# EAGLE design Breakout (EAGLE 7.6.0)
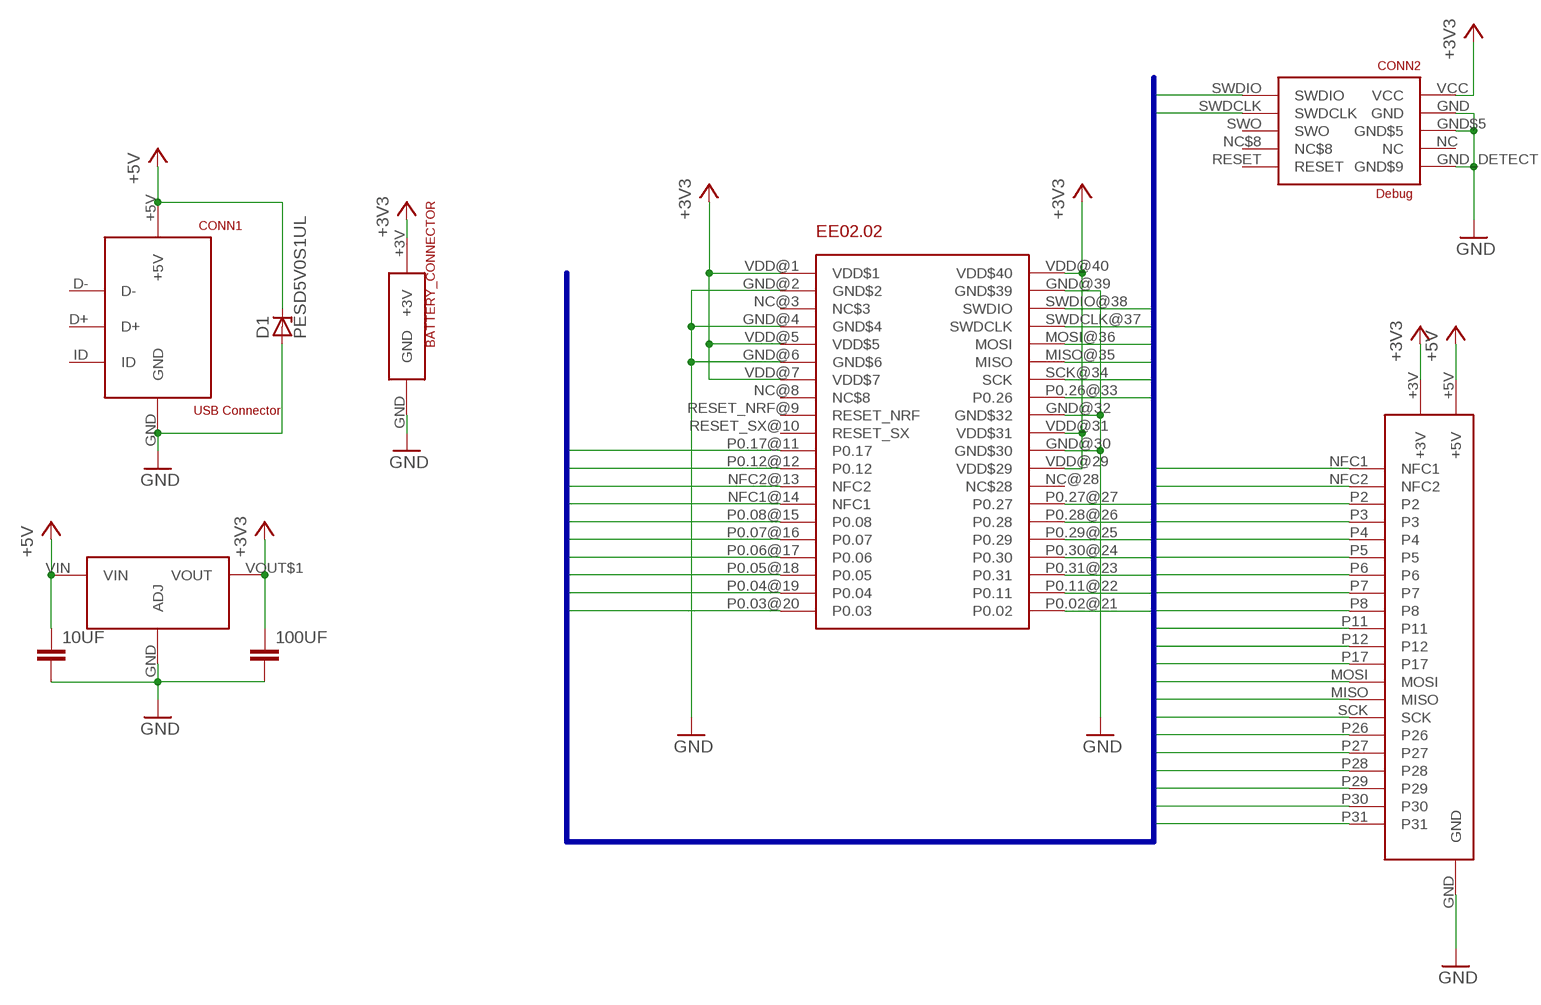
[diagram p0: schematic, sheet 1]

## Parts
10UF  4.7UF-0805  [0805]
100UF  4.7UF-0805  [0805]
BATTERY_CONNECTOR  3V_BATTERY_CONNECTOR  [3V_BATTERY_CONNECTOR]
CONN1  USB Connector  USB_MICRO_B  [USB_MICRO_B]
CONN2  Debug  DEBUGHEADER  [NRF52-P19-CONNECTOR]
D1  PESD5V0S1UL  [SOD882]
EE02.02  EE02_02  [EE02_02]
U$4  LM1117  [SOT-223]
U$5  EE02_SHIELD_HEADERSHIELD  [EE02_SHIELD_HEADER]

## Nets
+3V3: 100UF.1 BATTERY_CONNECTOR.+3V CONN2.VCC EE02.02.VDD@1(VDD$1) EE02.02.VDD@5(VDD$5) EE02.02.VDD@7(VDD$7) EE02.02.VDD@29(VDD$29) EE02.02.VDD@31(VDD$31) EE02.02.VDD@40(VDD$40) U$4.VOUT$1(VOUT) U$5.+3V
+5V: 10UF.1 CONN1.+5V D1.CATHODE(C) U$4.VIN U$5.+5V
GND: 10UF.2 100UF.2 BATTERY_CONNECTOR.GND CONN1.GND CONN2.GND CONN2.GND$5 CONN2.GND_DETECT(GND$9) D1.ANODE(A) EE02.02.GND@2(GND$2) EE02.02.GND@4(GND$4) EE02.02.GND@6(GND$6) EE02.02.GND@30(GND$30) EE02.02.GND@32(GND$32) EE02.02.GND@39(GND$39) U$4.GND(ADJ) U$5.GND
MISO: EE02.02.MISO@35(MISO) U$5.MISO
MOSI: EE02.02.MOSI@36(MOSI) U$5.MOSI
NFC1: EE02.02.NFC1@14(NFC1) U$5.NFC1
NFC2: EE02.02.NFC2@13(NFC2) U$5.NFC2
P2: EE02.02.P0.02@21(P0.02) U$5.P2
P3: EE02.02.P0.03@20(P0.03) U$5.P3
P4: EE02.02.P0.04@19(P0.04) U$5.P4
P5: EE02.02.P0.05@18(P0.05) U$5.P5
P6: EE02.02.P0.06@17(P0.06) U$5.P6
P7: EE02.02.P0.07@16(P0.07) U$5.P7
P8: EE02.02.P0.08@15(P0.08) U$5.P8
P11: EE02.02.P0.11@22(P0.11) U$5.P11
P12: EE02.02.P0.12@12(P0.12) U$5.P12
P17: EE02.02.P0.17@11(P0.17) U$5.P17
P26: EE02.02.P0.26@33(P0.26) U$5.P26
P27: EE02.02.P0.27@27(P0.27) U$5.P27
P28: EE02.02.P0.28@26(P0.28) U$5.P28
P29: EE02.02.P0.29@25(P0.29) U$5.P29
P30: EE02.02.P0.30@24(P0.30) U$5.P30
P31: EE02.02.P0.31@23(P0.31) U$5.P31
SCK: EE02.02.SCK@34(SCK) U$5.SCK
SWDCLK: CONN2.SWDCLK EE02.02.SWDCLK@37(SWDCLK)
SWDIO: CONN2.SWDIO EE02.02.SWDIO@38(SWDIO)
Unconnected: CONN1.D+ CONN1.D- CONN1.ID CONN2.NC CONN2.NC$8 CONN2.RESET CONN2.SWO EE02.02.NC@3(NC$3) EE02.02.NC@8(NC$8) EE02.02.NC@28(NC$28) EE02.02.RESET_NRF@9(RESET_NRF) EE02.02.RESET_SX@10(RESET_SX)

## Buses
NFC1,NFC2,P2,P3,P4,P5,P6,P7,P8,P11,P12,P17,P26,P27,P28,P29,P30,P31,MISO,MOSI,SCK,SWDIO,SWDCLK

## Library data of the parts
10UF 100UF = EE:4.7UF-0805
BATTERY_CONNECTOR = EE:3V_BATTERY_CONNECTOR
CONN1 = EE:USB_MICRO_B
CONN2 = EE:DEBUGHEADER: DEBUG HEADER
D1 = EE:PESD5V0S1UL: Unidirectional ESD protection diode; VALE: PESD5V0S1UL
EE02.02 = EE:EE02_02
U$4 = EE:LM1117
U$5 = EE:EE02_SHIELD_HEADER

## Board
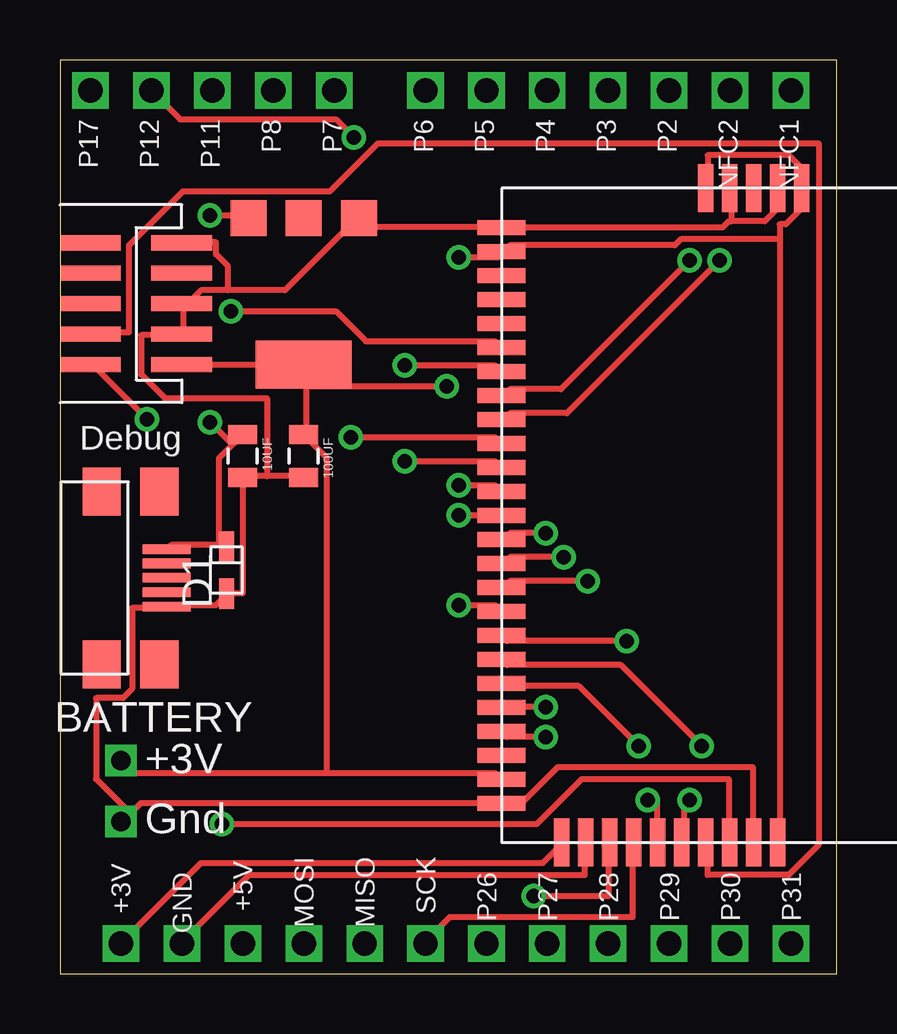
[diagram p1: board, top side]
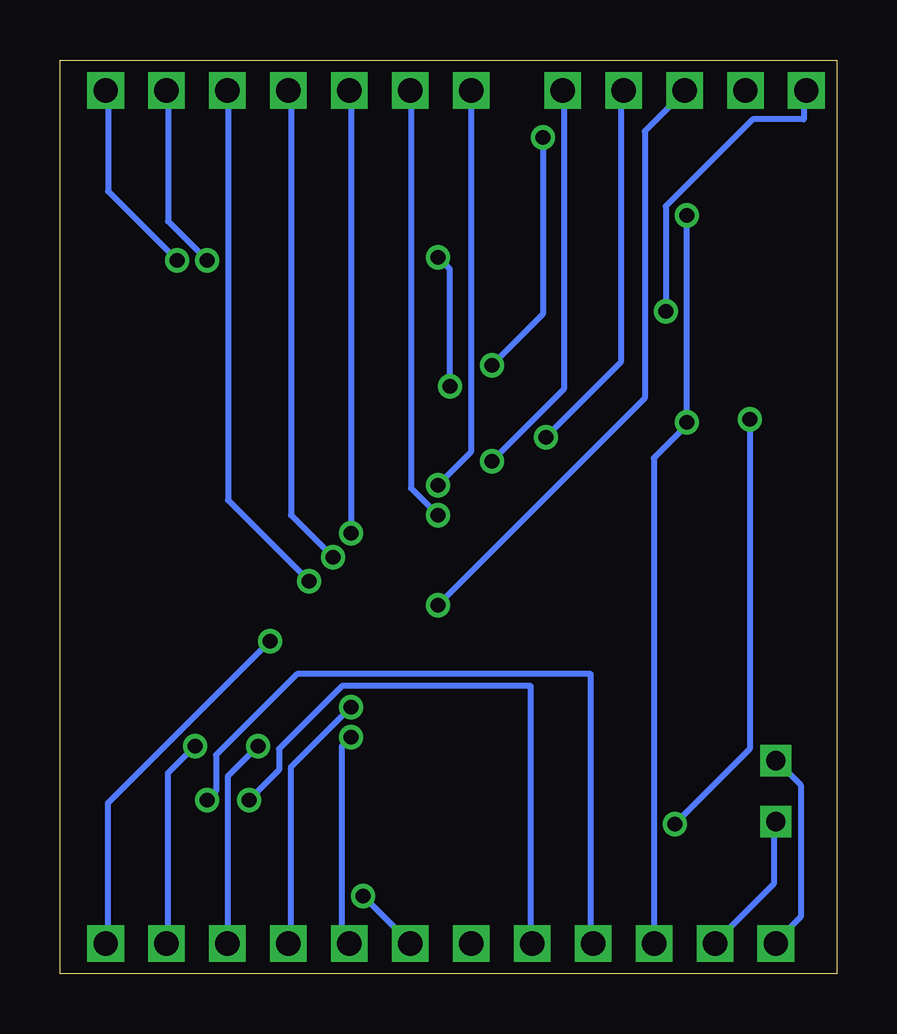
[diagram p2: board, bottom side, seen from below]

Size 32.38 x 38.1 mm. Coordinates in mm from the lower left corner, seen from the top.
Outline: 0,38.09 0,0 32.38,0 32.38,38.1 0,38.1
Copper layers (1*16): Top 0.035mm / dielectric 1.5mm / Bottom 0.035mm
Design rules "default": minimum track width 10mil, minimum drill 24mil, track to track 8mil, track to pad 8mil, pad to pad 8mil, via to via 8mil, smd to smd 8mil, copper to edge 40mil, drill to drill 8mil, minimum pad ring 10mil, minimum via ring 8mil, stop-mask expansion 4mil, vias tented up to drill 0mil, thermal gap 10mil

### Footprints (pad centres in the part's own frame; a part is rotated, then mirrored left to right if it is on the bottom)
0805 = smd 0.8 x 1.2: 1 -0.9,0; 2 0.9,0
3V_BATTERY_CONNECTOR = drill 0.8 square: +3V 0,2.54; GND 0,0
USB_MICRO_B = smd 0.4 x 2: +5V -1.2,1.9; D+ 0,1.9; D- -0.6,1.9; GND 1.2,1.9; ID 0.6,1.9 | smd 2 x 1.6: P$7 -3.6,1.6; P$8 3.6,1.6; P$9 3.6,-0.8; P$10 -3.6,-0.8
NRF52-P19-CONNECTOR = smd 2.54 x 0.635: GND -2.54,5.08; GND$5 -2.54,3.81; GND_DETECT -2.54,1.27; NC -2.54,2.54; NC$8 1.27,2.54; RESET 1.27,1.27; SWDCLK 1.27,5.08; SWDIO 1.27,6.35; SWO 1.27,3.81; VCC -2.54,6.35
SOD882 = smd 0.62 x 1.27: ANODE -1.95,-0.65; CATHODE -1.95,1.3
EE02_02 = smd 2 x 0.635: GND@2 -1.635,11.5; GND@4 -1.635,9.5; GND@32 25.635,3.5; GND@39 25.635,10.5; MISO@35 25.635,6.5; MOSI@36 25.635,7.5; NC@3 -1.635,10.5; P0.26@33 25.635,4.5; SCK@34 25.635,5.5; SWDCLK@37 25.635,8.5; SWDIO@38 25.635,9.5; VDD@1 -1.635,12.5; VDD@5 -1.635,8.5; VDD@31 25.635,2.5; VDD@40 25.635,11.5 | smd 0.635 x 2: GND@6 0,0; GND@30 24,0; NC@8 2,0; NC@28 22,0; NFC1@14 8,0; NFC2@13 7,0; P0.02@21 15,0; P0.03@20 14,0; P0.04@19 13,0; P0.05@18 12,0; P0.06@17 11,0; P0.07@16 10,0; P0.08@15 9,0; P0.11@22 16,0; P0.12@12 6,0; P0.17@11 5,0; P0.27@27 21,0; P0.28@26 20,0; P0.29@25 19,0; P0.30@24 18,0; P0.31@23 17,0; RESET_NRF@9 3,0; RESET_SX@10 4,0; VDD@7 1,0; VDD@29 23,0
SOT-223 = smd 1.5 x 1.5: GND -2.3,-6.1; P$2 0,-6.1; VIN 2.3,-6.1 | smd 4 x 2: VOUT$1 0,0
EE02_SHIELD_HEADER = drill 1.016 square: +3V 35.56,2.54; +5V 35.56,7.62; GND 35.56,5.08; MISO 35.56,12.7; MOSI 35.56,10.16; NFC1 0,30.48; NFC2 0,27.94; P2 0,25.4; P3 0,22.86; P4 0,20.32; P5 0,17.78; P6 0,15.24; P7 0,11.43; P8 0,8.89; P11 0,6.35; P12 0,3.81; P17 0,1.27; P26 35.56,17.78; P27 35.56,20.32; P28 35.56,22.86; P29 35.56,25.4; P30 35.56,27.94; P31 35.56,30.48; SCK 35.56,15.24

### Placement (x,y rotation side)
10UF  7.62,21.59 270 top
100UF  10.16,21.59 270 top
BATTERY_CONNECTOR  2.54,6.35 0 top
CONN1  2.54,16.51 270 top
CONN2  2.54,31.75 180 top
D1  8.89,16.51 0 top
EE02.02  18.41,31.11 270 top
U$4  10.16,25.4 180 top
U$5  0,36.83 270 top

### Tracks (layer width: path | path; a pad name or v marks a point on that pad's centre or on a via)
+3V3  (via drill 0.61)
  Top 0.254: 30,30.62 30,31.25 30.25,31.25 30.88,31.88 30.88,32.75 EE02.02.VDD@1 30.88,32.88 30.88,33.62 30.38,34.12 27,34.12 27,32.75 EE02.02.VDD@5 | 30,30.62 30,5.5 EE02.02.VDD@40 | 30,30.62 25.88,30.62 25.62,30.38 18.75,30.38 18.5,30.12 EE02.02.VDD@7 18.38,30 18.25,29.88 v16.62,29.88 | EE02.02.VDD@31 20.88,5.38 20.12,4.62 5.88,4.62 2.62,1.38 U$5.+3V | U$4.VOUT$1 10.25,25.38 10.25,22.5 100UF.1 10.25,22.38 11.12,21.5 11.12,8.38 | CONN2.VCC 5.12,25.38 10.12,25.38 U$4.VOUT$1 | 11.12,8.38 3.12,8.38 2.62,8.88 BATTERY_CONNECTOR.+3V | 11.12,8.38 18.12,8.38 18.38,8.12 EE02.02.VDD@29 | v16.12,24.5 10.38,24.5 U$4.VOUT$1
  Bottom 0.254: U$5.+3V 2.5,1.38 1.5,2.38 1.5,7.88 2.5,8.88 BATTERY_CONNECTOR.+3V | v16.62,29.88 16.12,29.38 v16.12,24.5
+5V  (via drill 0.61)
  Top 0.254: 6.62,17.88 6.62,21.5 7.5,22.38 10UF.1 7.12,22.12 v6.25,23 | 6.62,17.88 6.88,17.88 D1.CATHODE | v6.25,31.62 7.62,31.62 7.75,31.5 U$4.VIN | 6.62,17.88 4.62,17.88 4.5,17.75 CONN1.+5V
  Bottom 0.254: v6.25,31.62 v6.25,23 6.25,22.88 7.62,21.5 7.62,1.38 U$5.+5V
GND
  Top 0.254: EE02.02.GND@32 21.88,5.38 21.88,4.12 7.88,4.12 5.12,1.38 U$5.GND | EE02.02.GND@39 28.88,5.5 28.88,8.62 20.75,8.62 19.25,7.12 18.5,7.12 EE02.02.GND@30 18.38,7.12 3.38,7.12 2.62,6.38 BATTERY_CONNECTOR.GND 2.88,6.75 1.5,8.12 1.5,11.5 2.62,11.5 3,11.88 3,15.25 4.38,15.25 CONN1.GND 4.5,15.38 6.5,15.38 6.88,15.75 D1.ANODE 7,15.88 7.62,15.88 7.62,20.62 10UF.2 7.62,20.75 8.62,20.75 | 8.62,20.75 10.12,20.75 100UF.2 | 28,31.38 28,32.75 EE02.02.GND@4 | 28,31.38 29.38,31.38 29.88,31.88 29.88,32.75 EE02.02.GND@2 | 28,31.38 27.88,31.38 27.62,31.12 18.5,31.12 EE02.02.GND@6 18.38,31.12 12.88,31.12 12.5,31.5 U$4.GND 12.38,31.5 9.38,28.5 7,28.5 | 7,28.5 5.88,28.5 5.25,27.88 CONN2.GND$5 5.12,27.88 5.12,26.75 CONN2.GND 5,26.62 3.38,26.62 3.38,25 4.38,24 8.62,24 8.62,20.75 | 7,28.5 7,29.5 6.5,30 6.5,30.5 5.5,30.5 CONN2.GND_DETECT
  Bottom 0.254: U$5.GND 5,1.38 2.62,3.75 2.62,6.25 BATTERY_CONNECTOR.GND
MISO  (via drill 0.61)
  Top 0.254: v24.5,7.25 24.88,7.25 24.88,5.5 EE02.02.MISO@35
  Bottom 0.254: v24.5,7.25 23.25,8.5 23.25,9.38 20.62,12 12.75,12 12.75,1.38 U$5.MISO
MOSI  (via drill 0.61)
  Top 0.254: v26.25,7.25 26,7.25 26,5.5 EE02.02.MOSI@36
  Bottom 0.254: v26.25,7.25 25.88,7.62 25.88,9.12 22.5,12.5 10.25,12.5 10.25,1.38 U$5.MOSI
NFC1  (via drill 0.61)
  Top 0.254: v27.5,29.75 21.12,23.38 18.75,23.38 18.5,23.12 EE02.02.NFC1@14
  Bottom 0.254: v27.5,29.75 30.38,32.62 30.38,36.75 U$5.NFC1
NFC2  (via drill 0.61)
  Top 0.254: v26.25,29.75 20.88,24.38 18.75,24.38 18.5,24.12 EE02.02.NFC2@13
  Bottom 0.254: v26.25,29.75 27.88,31.38 27.88,36.75 U$5.NFC2
P2  (via drill 0.61)
  Top 0.254: v22,16.38 18.75,16.38 18.5,16.12 EE02.02.P0.02@21
  Bottom 0.254: v22,16.38 25.38,19.75 25.38,36.75 U$5.P2
P3  (via drill 0.61)
  Top 0.254: v21,17.38 18.75,17.38 18.5,17.12 EE02.02.P0.03@20
  Bottom 0.254: v21,17.38 22.75,19.12 22.75,36.75 U$5.P3
P4  (via drill 0.61)
  Top 0.254: v20.25,18.38 18.75,18.38 18.5,18.12 EE02.02.P0.04@19
  Bottom 0.254: v20.25,18.38 20.25,36.75 U$5.P4
P5  (via drill 0.61)
  Top 0.254: v16.62,19.12 18.38,19.12 EE02.02.P0.05@18
  Bottom 0.254: v16.62,19.12 17.75,20.25 17.75,36.75 U$5.P5
P6  (via drill 0.61)
  Top 0.254: v16.62,20.38 18.12,20.38 18.38,20.12 EE02.02.P0.06@17
  Bottom 0.254: v16.62,20.38 15.25,21.75 15.25,36.75 U$5.P6
P7  (via drill 0.61)
  Top 0.254: v14.38,21.38 18.12,21.38 18.38,21.12 EE02.02.P0.07@16
  Bottom 0.254: v14.38,21.38 11.38,24.38 11.38,36.75 U$5.P7
P8  (via drill 0.61)
  Top 0.254: v12.12,22.38 18.12,22.38 18.38,22.12 EE02.02.P0.08@15
  Bottom 0.254: v12.12,22.38 9,25.5 9,36.75 U$5.P8
P11  (via drill 0.61)
  Top 0.254: v16.62,15.38 18.12,15.38 18.38,15.12 EE02.02.P0.11@22
  Bottom 0.254: v16.62,15.38 8,24 8,35.12 6.38,36.75 U$5.P11
P12  (via drill 0.61)
  Top 0.254: v14.38,25.38 18.12,25.38 18.38,25.12 EE02.02.P0.12@12 | v12.25,34.88 11.5,35.62 5,35.62 3.88,36.75 U$5.P12
  Bottom 0.254: v14.38,25.38 12.25,27.5 v12.25,34.88
P17  (via drill 0.61)
  Top 0.254: v7.12,27.62 11.5,27.62 12.75,26.38 18.12,26.38 18.38,26.12 EE02.02.P0.17@11
  Bottom 0.254: v7.12,27.62 7.12,32 3.5,35.62 1.38,35.62 1.38,36.75 U$5.P17
P26  (via drill 0.61)
  Top 0.254: v19.75,3.25 22.88,3.25 22.88,5.38 EE02.02.P0.26@33
  Bottom 0.254: v19.75,3.25 17.88,1.38 U$5.P26
P27  (via drill 0.61)
  Top 0.254: v20.25,9.88 18.62,9.88 18.5,10 EE02.02.P0.27@27
  Bottom 0.254: v20.25,9.88 20.62,9.5 20.62,1.62 20.38,1.38 U$5.P27
P28  (via drill 0.61)
  Top 0.254: v20.25,11.12 18.5,11.12 EE02.02.P0.28@26
  Bottom 0.254: v20.25,11.12 22.75,8.62 22.75,1.38 U$5.P28
P29  (via drill 0.61)
  Top 0.254: v24.12,9.5 21.62,12 18.5,12 EE02.02.P0.29@25
  Bottom 0.254: v24.12,9.5 25.38,8.25 25.38,1.38 U$5.P29
P30  (via drill 0.61)
  Top 0.254: v26.75,9.5 23.38,12.88 18.62,12.88 18.5,13 EE02.02.P0.30@24
  Bottom 0.254: v26.75,9.5 27.88,8.38 27.88,1.38 U$5.P30
P31  (via drill 0.61)
  Top 0.254: v23.62,13.88 18.62,13.88 18.5,14 EE02.02.P0.31@23
  Bottom 0.254: v23.62,13.88 30.38,7.12 30.38,1.38 U$5.P31
SCK
  Top 0.254: EE02.02.SCK@34 23.88,5.38 23.88,2.38 16.25,2.38 15.25,1.38 U$5.SCK
SWDCLK
  Top 0.254: EE02.02.SWDCLK@37 27,5.38 27,4.12 30.38,4.12 31.62,5.38 31.62,34.62 13.25,34.62 11.25,32.62 5.12,32.62 2.88,30.38 2.88,26.75 1.38,26.75 CONN2.SWDCLK
SWDIO  (via drill 0.61)
  Top 0.254: v6.75,6.25 19.88,6.25 21.75,8.12 27.88,8.12 27.88,5.5 EE02.02.SWDIO@38 | v3.62,23.12 1.38,25.38 CONN2.SWDIO
  Bottom 0.254: v6.75,6.25 3.62,9.38 v3.62,23.12